# EAGLE design main_board_v2 (EAGLE 7.7.0)
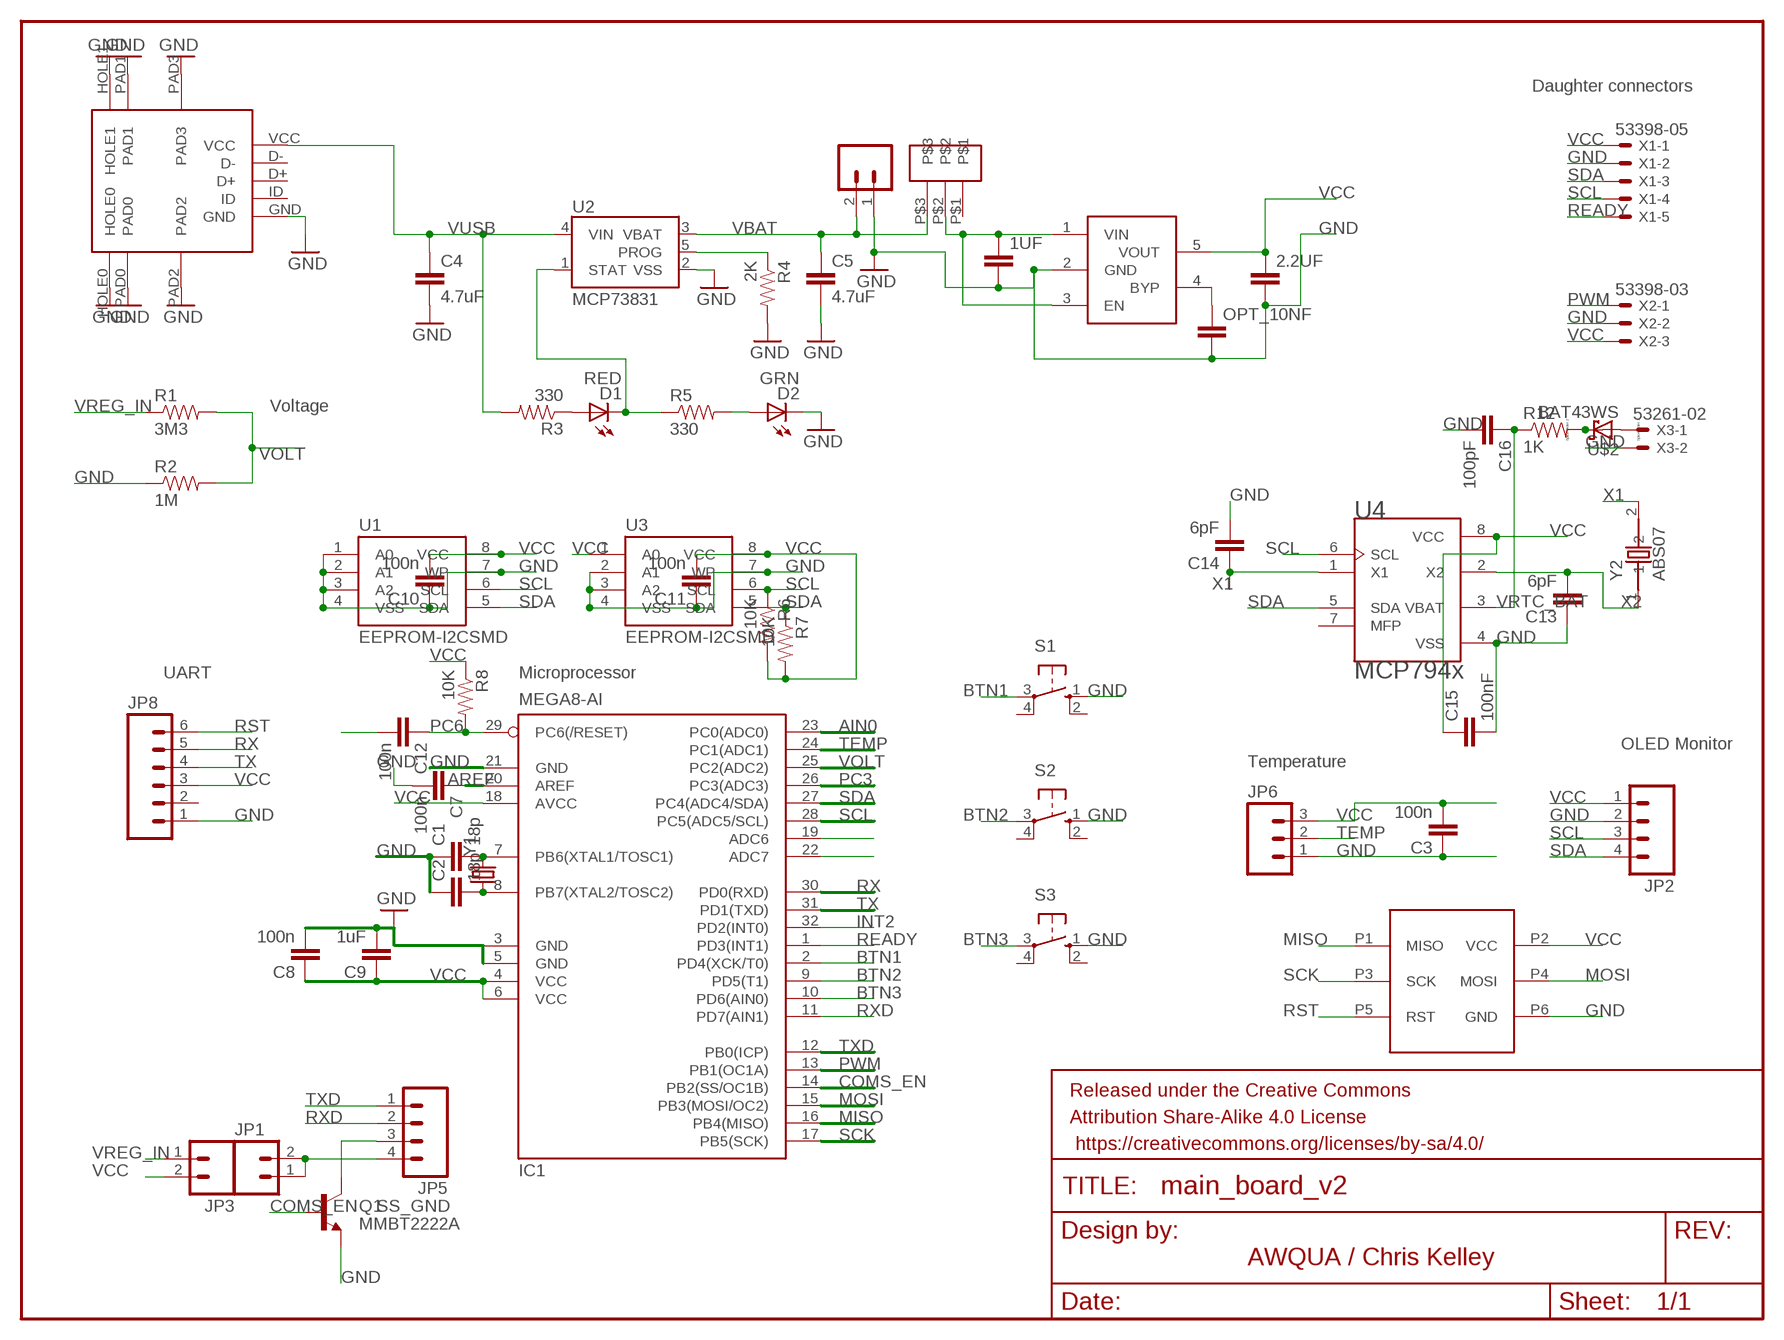
[diagram p0: schematic, sheet 1]

## Parts
1UF  CAP0603-CAP  [0603-CAP]
2.2UF  CAP0603-CAP  [0603-CAP]
C1  18p  CAP0603-CAP  [0603-CAP]
C2  18p  CAP0603-CAP  [0603-CAP]
C3  100n  CAP0603-CAP  [0603-CAP]
C4  4.7uF  CAP0402-CAP  [0402-CAP]
C5  4.7uF  CAP0402-CAP  [0402-CAP]
C7  100n  CAP0603-CAP  [0603-CAP]
C8  100n  CAP0603-CAP  [0603-CAP]
C9  1uF  CAP0603-CAP  [0603-CAP]
C10  100n  CAP0603-CAP  [0603-CAP]
C11  100n  CAP0603-CAP  [0603-CAP]
C12  100n  CAP0603-CAP  [0603-CAP]
C13  6pF  CAP0603-CAP  [0603-CAP]
C14  6pF  CAP0603-CAP  [0603-CAP]
C15  100nF  CAP0603-CAP  [0603-CAP]
C16  100pF  CAP0603-CAP  [0603-CAP]
D1  RED  LED0603  [LED-0603]
D2  GRN  LED0603  [LED-0603]
FRAME1  FRAME-LETTER  [CREATIVE_COMMONS]
IC1  MEGA8-AI  [TQFP32-08]
JP1  M02PTH  [1X02]
JP2  M04PTH  [1X04]
JP3  M02PTH  [1X02]
JP5  M04PTH  [1X04]
JP6  M03PTH  [1X03]
JP7  LiPo Battery  M02-JST-2MM-SMT  [JST-2-SMD]
JP8  M06SILK_FEMALE_PTH  [1X06]
OPT_10NF  CAP0603-CAP  [0603-CAP]
Q1  MMBT2222A  TRANSISTOR_NPNMMBT2222A  [SOT23-3]
R1  3M3  RESISTOR0603  [0603-RES]
R2  1M  RESISTOR0603  [0603-RES]
R3  330  RESISTOR0402-RES  [0402-RES]
R4  2K  RESISTOR0402-RES  [0402-RES]
R5  330  RESISTOR0402-RES  [0402-RES]
R6  10K  RESISTOR0603-RES  [0603-RES]
R7  10K  RESISTOR0603-RES  [0603-RES]
R8  10K  RESISTOR0402-RES  [0402-RES]
R12  1K  RESISTOR0603-RES  [0603-RES]
S1  40-XX  [B3F-40XX]
S2  40-XX  [B3F-40XX]
S3  40-XX  [B3F-40XX]
U1  EEPROM-I2CSMD  [SO08]
U2  MCP73831  [SOT23-5]
U3  EEPROM-I2CSMD  [SO08]
U4  MCP794x  MCP7940M-I/SN  [SOIC127P600X175-8N]
U$1  ISP-SMD-6PIN  [ISP-SMD-6PIN]
U$2  BAT43WS  [BAT43WS]
U$3  USBMICRO-10118193-0001LF  [USBMICRO-10118193-0001LF]
U$6  LP2985  [LP2985]
U$7  OS102-SPDT-SWITCH  [OS102-SPDT-SWITCH]
X1  53398-05  [53398-05]
X2  53398-03  [53398-03]
X3  53261-02  [53261-02]
Y1  CRYSTAL5X3  [CRYSTAL-SMD-5X3]
Y2  ABS07  ABS07-32.768KHZ-T  [XTAL320X150X90]

## Nets
AIN0: IC1.23(PC0(ADC0))
AREF: C7.1 IC1.20(AREF)
BTN1: IC1.2(PD4(XCK/T0)) S1.3(P)
BTN2: IC1.9(PD5(T1)) S2.3(P)
BTN3: IC1.10(PD6(AIN0)) S3.3(P)
BYPASS: OPT_10NF.1 U$6.4(BYP)
COMS_EN: IC1.14(PB2(SS/OC1B)) Q1.1(B)
GND: 1UF.2 2.2UF.2 C1.1 C2.1 C3.1 C4.2 C5.2 C7.2 C8.2 C9.2 C10.1 C11.1 C13.1 C14.2 C15.2 C16.2 D2.C IC1.3(GND) IC1.5(GND) IC1.19(ADC6) IC1.21(GND) IC1.22(ADC7) JP2.2 JP6.1 JP7.1 JP8.1 OPT_10NF.2 Q1.2(E) R2.1 R4.2 S1.1(S) S2.1(S) S3.1(S) U1.1(A0) U1.2(A1) U1.3(A2) U1.4(VSS) U1.7(WP) U2.2(VSS) U3.2(A1) U3.3(A2) U3.4(VSS) U3.7(WP) U4.4(VSS) U$1.P6(GND) U$3.GND U$3.HOLE0 U$3.HOLE1 U$3.PAD0 U$3.PAD1 U$3.PAD2 U$3.PAD3 U$6.2(GND) X1.2 X2.2 X3.2
INT2: IC1.32(PD2(INT0))
MISO: IC1.16(PB4(MISO)) U$1.P1(MISO)
MOSI: IC1.15(PB3(MOSI/OC2)) U$1.P4(MOSI)
N$1: D1.A R3.1
N$2: U$2.PIN1(C) X3.1
N$3: JP1.1 JP1.2 JP5.4
N$4: R12.2 U$2.PIN2(A)
N$5: D2.A R5.2
PC3: IC1.26(PC3(ADC3))
PC6: C12.1 IC1.29(PC6(/RESET)) R8.2
PROG: R4.1 U2.5(PROG)
PWM: IC1.13(PB1(OC1A)) X2.1
Q1: C2.2 IC1.8(PB7(XTAL2/TOSC2)) Y1.1
Q2: C1.2 IC1.7(PB6(XTAL1/TOSC1)) Y1.3
READY: IC1.1(PD3(INT1)) X1.5
RST: C12.2 JP8.6 U$1.P5(RST)
RX: IC1.30(PD0(RXD)) JP8.5
RXD: IC1.11(PD7(AIN1)) JP5.2
SCK: IC1.17(PB5(SCK)) U$1.P3(SCK)
SCL: IC1.28(PC5(ADC5/SCL)) JP2.3 R6.1 U1.6(SCL) U3.6(SCL) U4.6(SCL) X1.4
SDA: IC1.27(PC4(ADC4/SDA)) JP2.4 R7.1 U1.5(SDA) U3.5(SDA) U4.5(SDA) X1.3
SS_GND: JP5.3 Q1.3(C)
STAT: D1.C R5.1 U2.1(STAT)
TEMP: IC1.24(PC1(ADC1)) JP6.2
TX: IC1.31(PD1(TXD)) JP8.4
TXD: IC1.12(PB0(ICP)) JP5.1
VBAT: C5.1 JP7.2 U2.3(VBAT) U$7.P$3
VCC: 2.2UF.1 C3.2 C8.1 C9.1 C10.2 C11.2 C15.1 IC1.4(VCC) IC1.6(VCC) IC1.18(AVCC) JP2.1 JP3.2 JP6.3 JP8.3 R6.2 R7.2 R8.1 U1.8(VCC) U3.1(A0) U3.8(VCC) U4.8(VCC) U$1.P2(VCC) U$6.5(VOUT) X1.1 X2.3
VOLT: IC1.25(PC2(ADC2)) R1.2 R2.2
VREG_IN: 1UF.1 JP3.1 R1.1 U$6.1(VIN) U$6.3(EN) U$7.P$2
VRTC_BAT: C16.1 R12.1 U4.3(VBAT)
VUSB: C4.1 R3.2 U2.4(VIN) U$3.VCC
X1: C14.1 U4.1(X1) Y2.2
X2: C13.2 U4.2(X2) Y2.1
Unconnected: JP8.2 S1.2(S1) S1.4(P1) S2.2(S1) S2.4(P1) S3.2(S1) S3.4(P1) U4.7(MFP) U$3.D+ U$3.D- U$3.ID U$7.P$1

## Notes on the sheet
- Daughter connectors
- Voltage
- UART | Microprocessor
- OLED Monitor
- Temperature
- AWQUA / Chris Kelley

## Library data of the parts
1UF 2.2UF C13-C16 OPT_10NF = SparkFun-Passives:CAP: Capacitor Standard 0603 ceramic capacitor, and 0.1" leaded capacitor.
C1-C5 C7-C12 = SparkFun:CAP: Capacitor Standard 0603 ceramic capacitor, and 0.1" leaded capacitor.
D1 D2 = SparkFun:LED: LEDs Standard schematic elements and footprints for 5mm, 3mm, 1206, and 0603 sized LEDs. 5mm - Spark Fun Electronics SKU : COM-00529 (and others)
FRAME1 = SparkFun-Aesthetics:FRAME-LETTER: Schematic Frame Standard 8.5x11 US Letter frame
IC1 = atmel:MEGA8: MICROCONTROLLER 8 Kbytes FLASH, 1 kbytes SRAM, 512 bytes EEPROM, USART, 6-channel 10 bit ADC, 2-channel 8 bit ADC Pin compatible with Atmega48, ATMega88, ATMega168 Source: avr.lbr; MPN: ATMEGA8-16AU; OC_FARNELL: 9171371; OC_NEWARK: 73M8863
JP1 JP3 = SparkFun-Connectors:M02: Standard 2-pin 0.1" header. Use with - straight break away headers ( PRT-00116) - right angle break away headers (PRT-00553) - swiss pins (PRT-00743) - machine pins (PRT-00117) - female headers (PRT-00115) Molex polarized connector foot print use with: PRT-08233 with associated crimp pins and housings. 2.54_SCREWTERM for use with PRT-10571. 3.5mm Screw Terminal footprints for PRT-08084 5mm Screw Terminal footprints for use with PRT-08432
JP2 JP5 = SparkFun-Connectors:M04: Header 4 Standard 4-pin 0.1" header. Use with straight break away headers (SKU : PRT-00116), right angle break away headers (PRT-00553), swiss pins (PRT-00743), machine pins (PRT-00117), and female headers (PRT-00115). Molex polarized connector foot print use with SKU : PRT-08231 with associated crimp pins and housings. 1MM SMD Version SKU: PRT-10208
JP6 = SparkFun-Connectors:M03: Header 3 Standard 3-pin 0.1" header. Use with straight break away headers (SKU : PRT-00116), right angle break away headers (PRT-00553), swiss pins (PRT-00743), machine pins (PRT-00117), and female headers (PRT-00115). Molex polarized connector foot print use with SKU : PRT-08232 with associated crimp pins and housings.
JP7 = SparkFun:M02: Header 2 Standard 2-pin 0.1" header. Use with straight break away headers (SKU : PRT-00116), right angle break away headers (PRT-00553), swiss pins (PRT-00743), machine pins (PRT-00117), and female headers (PRT-00115). Molex polarized connector foot print use with SKU : PRT-08233 with associated crimp pins and housings.
JP8 = SparkFun-Connectors:M06: Header 6 Standard 6-pin 0.1" header. Use with straight break away headers (SKU : PRT-00116), right angle break away headers (PRT-00553), swiss pins (PRT-00743), machine pins (PRT-00117), and female headers (PRT-00115). Molex polarized connector foot print use with SKU : PRT-08094 with associated crimp pins and housings. NOTES ON THE VARIANTS LOCK and LOCK_LONGPADS... This footprint was designed to help hold the alignment of a through-hole component (i.e. 6-pin header) while soldering it into place. You may notice that each hole has been shifted either up or down by 0.005 of an inch from it's more standard position (which is a perfectly straight line). This slight alteration caused the pins (the squares in the middle) to touch the edges of the holes. Because they are alternating, it causes a "brace" to hold the component in place. 0.005 has proven to be the perfect amount of "off-center" position when using our standard breakaway headers. Although looks a little odd when you look at the bare footprint, once you have a header in there, the alteration is very hard to notice. Also,if you push a header all the way into place, it is covered up entirely on the bottom side. This idea of altering the position of holes to aid alignment will be further integrated into the Sparkfun Library for other footprints. It can help hold any component with 3 or more connection pins.; PROD_ID: CONN-08437
Q1 = SparkFun-DiscreteSemi:TRANSISTOR_NPN: Generic NPN BJT MMBT2222A - TRANS-08049 (SOT-23, 1A 40V) MPSA42 - TRANS-09116 (SOT-23, 500mA 300V) MMBT5088LT1G - TRANS-11160 (SOT-23, 50 mA 30V) BC547 - COM-08928 <http://www.sparkfun.com/products/8928> (TO-92 45V 100mA) (1.Collector 2.Base 3.Emitter) 2N3904 - COM-00521 <http://www.sparkfun.com/products/521> (TO-92 40V 200mA) (1.Emitter 2.Base 3.Collector) P2N2222A - COM-12852 <http://www.sparkfun.com/products/12852> (TO-92 40V 600mA) (1.Collector 2.Base 3.Emitter); PROD_ID: TRANS-08049
R1 R2 = SparkFun-Resistors:RESISTOR: Resistor Basic schematic elements and footprints for 0603, 1206, and PTH resistors.
R3-R8 = SparkFun:RESISTOR: Resistor Basic schematic elements and footprints for 0603, 1206, and PTH resistors.
R12 = SparkFun-Passives:RESISTOR: Resistor Basic schematic elements and footprints for 0603, 1206, and PTH resistors.
S1-S3 = adafruit:40-XX: OMRON SWITCH; MF: OMRON COMPONENTS USA; MPN: B3F-4000; OC_FARNELL: 176434; OC_NEWARK: 36K3105
U1 U3 = SparkFun-DigitalIC:EEPROM-I2C: I2C EEPROM chips, 24LC256 (and others)
U2 = SparkFun:MCP73831: Microchip's MCP73831 Miniature single cell, fully integrated Li-Ion, Li-polymer charge management controller http://ww1.microchip.com/downloads/en/DeviceDoc/21984a.pdf
U4 = MCP7940M-I_SN:MCP7940M-I/SN: MCP7940M Series 5.5 V 64 byte I2C Real-Time Clock/Calendar with SRAM - SOIC-8; AVAILABILITY: Good; DESCRIPTION: MCP7940M Series 5.5 V 64 byte I2C Real-Time Clock/Calendar with SRAM - SOIC-8; MF: Microchip; MP: MCP7940M-I/SN; PACKAGE: SOIC-8 Microchip; PRICE: 0.62 USD
U$1 = awqua_eagle_library:ISP-SMD-6PIN
U$2 = BAT43WS:BAT43WS
U$3 = awqua_eagle_library:USBMICRO-10118193-0001LF
U$6 = awqua_eagle_library:LP2985
U$7 = awqua_eagle_library:OS102-SPDT-SWITCH
X1 = con-molex:53?-05: CONNECTOR wire to board 1.25 mm (.049 inch) pitch header; OC_FARNELL: 1125354; OC_NEWARK: unknown
X2 = con-molex:53?-03: CONNECTOR wire to board 1.25 mm (.049 inch) pitch header; OC_FARNELL: unknown; OC_NEWARK: unknown
X3 = con-molex:53?-02: CONNECTOR wire to board 1.25 mm (.049 inch) pitch header; OC_FARNELL: 1125373; OC_NEWARK: unknown
Y1 = SparkFun:CRYSTAL: Crystals Various standard crystals. Proven footprints. Spark Fun Electronics SKU : COM-00534
Y2 = ABS07-32.768KHZ-T:ABS07-32.768KHZ-T: ABS07 Series 32.768 kHz ±20 ppm 12.5 pF -40 to +85 °C SMT Low Profile Crystal; AVAILABILITY: Good; DESCRIPTION: ABS07 Series 32.768 kHz %C2%B120 ppm 12.5 pF -40 to %2B85 %C2%B0C SMT Low Profile Crystal; MF: Abracon; MP: ABS07-32.768KHZ-T; PACKAGE: 0805 Abracon; PRICE: 0.44 USD

## Board
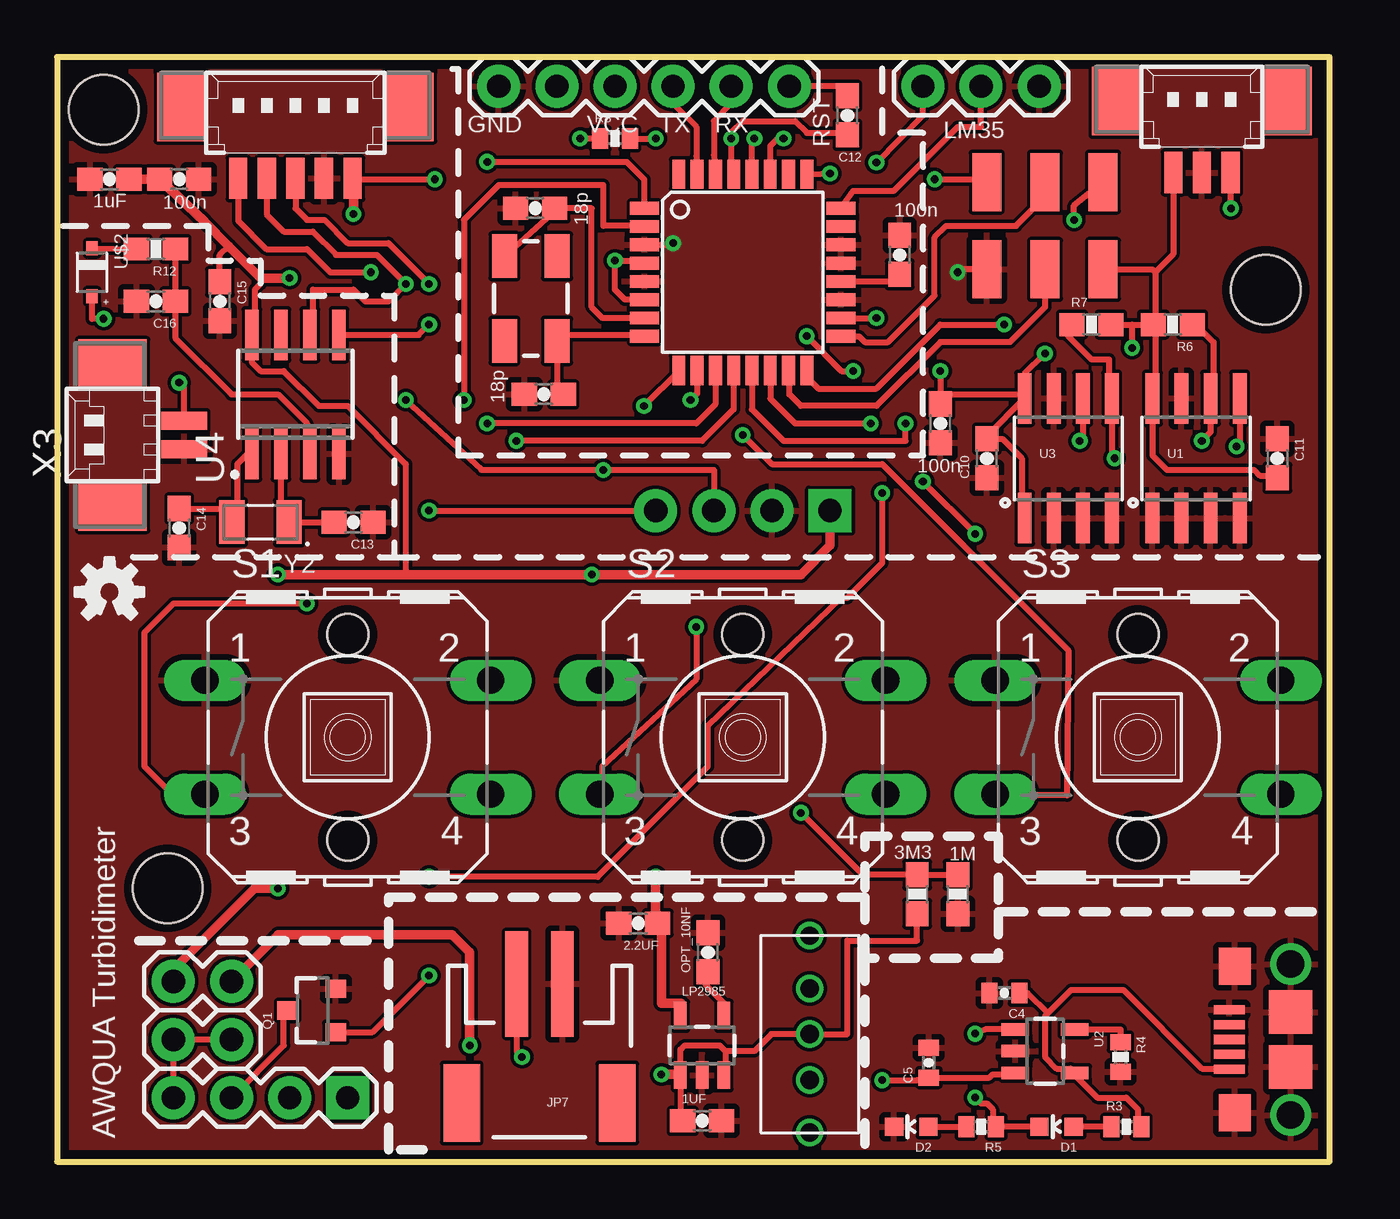
[diagram p1: board, top side]
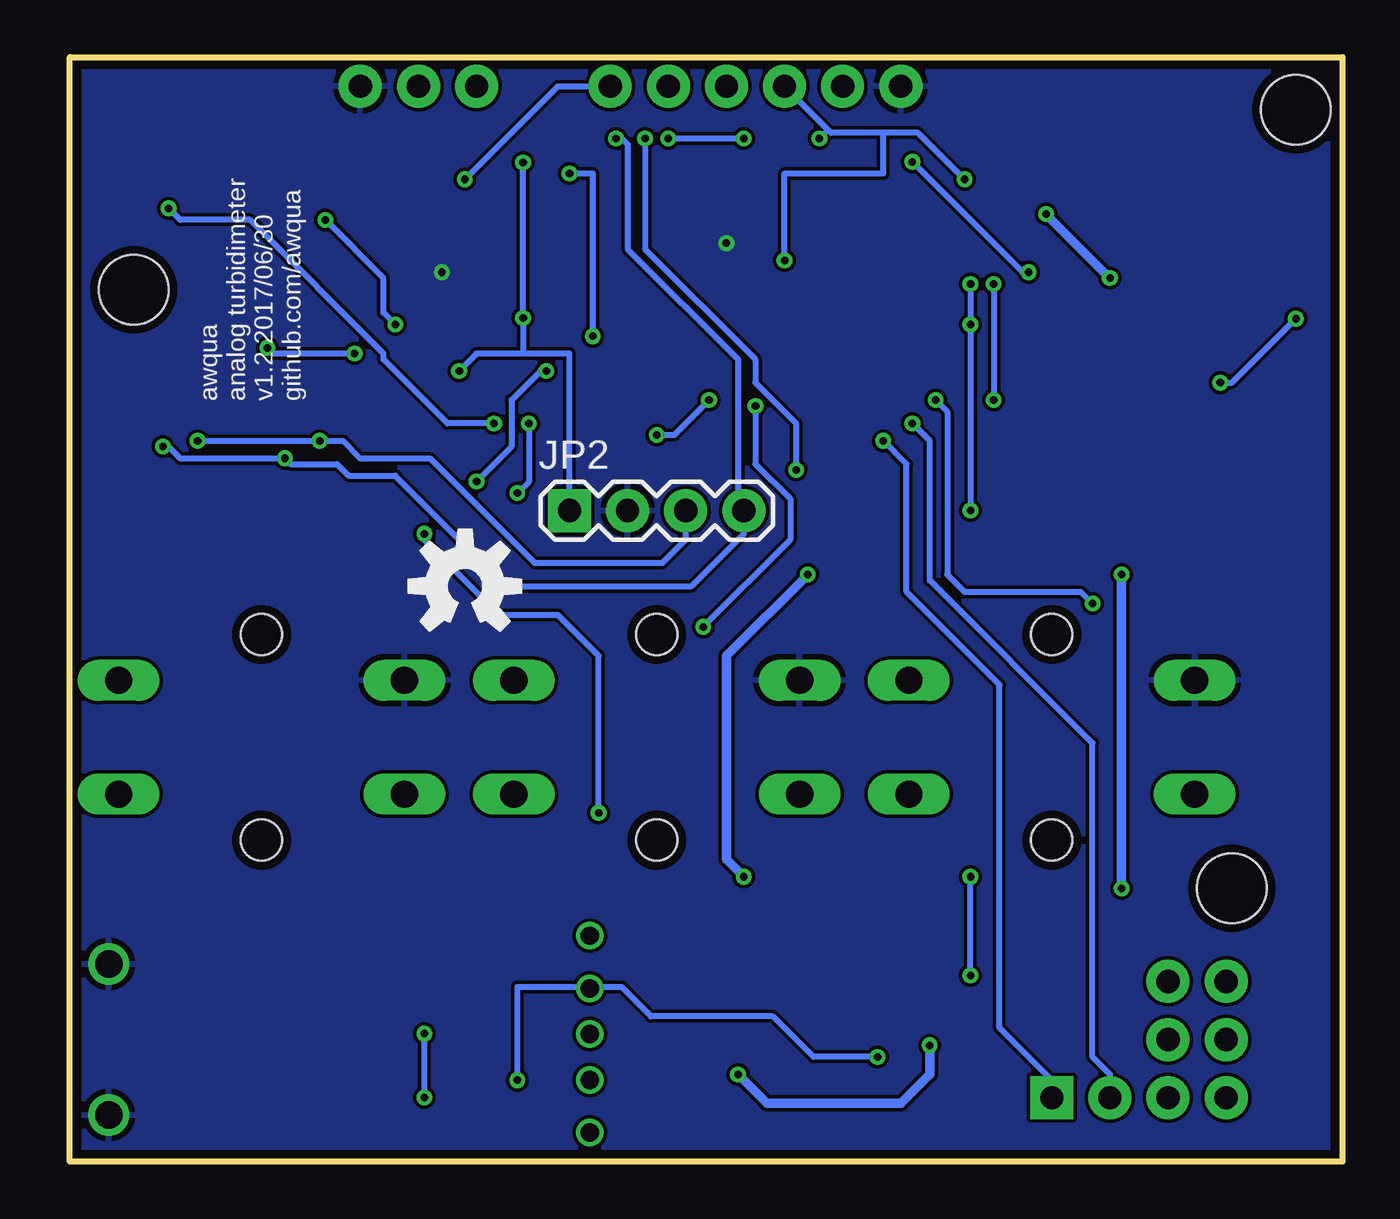
[diagram p2: board, bottom side, seen from below]

Size 55.63 x 48.26 mm. Coordinates in mm from the lower left corner, seen from the top.
Outline: 0,0 55.63,0 55.63,48.26 0,48.26 0,0
Copper layers (1*16): Top 0.0356mm / dielectric 1.5011mm / Bottom 0.0356mm
Design rules "default *": minimum track width 6mil, minimum drill 13mil, track to track 6mil, track to pad 6mil, pad to pad 6mil, via to via 6mil, smd to smd 6mil, copper to edge 15mil, drill to drill 6mil, minimum pad ring 7mil, minimum via ring 7mil, stop-mask expansion 4mil, vias tented up to drill 15mil, thermal gap 10mil
Holes 3.05 mm at 2.03,45.97 52.83,38.1 4.83,11.94

### Footprints (pad centres in the part's own frame; a part is rotated, then mirrored left to right if it is on the bottom)
0603-CAP = smd 1.1 x 1: 1 -0.85,0; 2 0.85,0
0402-CAP = smd 0.7 x 0.9: 1 -0.65,0; 2 0.65,0
LED-0603 = smd 0.8 x 0.8: A 0,-0.75; C 0,0.75
TQFP32-08 = smd 1.27 x 0.559: 1 -4.293,2.8; 2 -4.293,2; 3 -4.293,1.2; 4 -4.293,0.4; 5 -4.293,-0.4; 6 -4.293,-1.2; 7 -4.293,-2; 8 -4.293,-2.8; 17 4.293,-2.8; 18 4.293,-2; 19 4.293,-1.2; 20 4.293,-0.4; 21 4.293,0.4; 22 4.293,1.2; 23 4.293,2; 24 4.293,2.8 | smd 0.559 x 1.27: 9 -2.8,-4.293; 10 -2,-4.293; 11 -1.2,-4.293; 12 -0.4,-4.293; 13 0.4,-4.293; 14 1.2,-4.293; 15 2,-4.293; 16 2.8,-4.293; 25 2.8,4.293; 26 2,4.293; 27 1.2,4.293; 28 0.4,4.293; 29 -0.4,4.293; 30 -1.2,4.293; 31 -2,4.293; 32 -2.8,4.293
1X02 = drill 1.016 pad 1.88: 1 0,0; 2 2.54,0
1X04 = drill 1.016 pad 1.88 square: 1 0,0 | drill 1.016 pad 1.88: 2 2.54,0; 3 5.08,0; 4 7.62,0
1X03 = drill 1.016 pad 1.88: 1 0,0; 2 2.54,0; 3 5.08,0
JST-2-SMD = smd 1 x 4.6: 1 -1,-3.7; 2 1,-3.7 | smd 1.6 x 3.4: NC1 -3.4,1.5; NC2 3.4,1.5
1X06 = drill 1.016 pad 1.88: 1 0,0; 2 2.54,0; 3 5.08,0; 4 7.62,0; 5 10.16,0; 6 12.7,0
SOT23-3 = smd 0.8 x 0.9: 1 -0.95,-1; 2 0.95,-1; 3 0,1.1
0603-RES = smd 1.1 x 1: 1 -0.85,0; 2 0.85,0
0402-RES = smd 0.7 x 0.9: 1 -0.65,0; 2 0.65,0
B3F-40XX = drill 1.194 long: 1 -6.248,2.489; 2 6.248,2.489; 3 -6.248,-2.489; 4 6.248,-2.489 | hole 1.803: 0,-4.496; 0,4.496
SO08 = smd 0.61 x 2.21: 1 -1.905,-2.616; 2 -0.635,-2.616; 3 0.635,-2.616; 4 1.905,-2.616; 5 1.905,2.616; 6 0.635,2.616; 7 -0.635,2.616; 8 -1.905,2.616
SOT23-5 = smd 0.55 x 1.2: 1 -0.95,-1.3; 2 0,-1.3; 3 0.95,-1.3; 4 0.95,1.3; 5 -0.95,1.3
SOIC127P600X175-8N = smd 2.2 x 0.6: 1 -2.6,1.905; 2 -2.6,0.635; 3 -2.6,-0.635; 4 -2.6,-1.905; 5 2.6,-1.905; 6 2.6,-0.635; 7 2.6,0.635; 8 2.6,1.905
ISP-SMD-6PIN = smd 1.27 x 2.54: P1 2.54,1.905; P2 2.54,-1.905; P3 0,1.905; P4 0,-1.905; P5 -2.54,1.905; P6 -2.54,-1.905
BAT43WS = smd 0.6 x 0.5: PIN1 1.05,0; PIN2 -1.05,0
USBMICRO-10118193-0001LF = smd 0.4 x 1.35: D+ 0,4.125; D- -0.65,4.125; GND 1.3,4.125; ID 0.65,4.125; VCC -1.3,4.125 | drill 1.2 pad 1.6: HOLE0 3.3,1.45; HOLE1 -3.3,1.45 | smd 1.9 x 1.9: PAD0 1.2,1.45; PAD1 -1.2,1.45 | smd 1.6 x 1.4: PAD2 3.2,3.9; PAD3 -3.2,3.9
LP2985 = smd 0.55 x 1.2: 1 0.32,-0.03; 2 1.27,-0.03; 3 2.22,-0.03; 4 2.22,2.57; 5 0.32,2.57
OS102-SPDT-SWITCH = drill 0.8: ANCHOR1 0,2.15; ANCHOR2 8.6,2.15; P$1 2.3,2.15; P$2 4.3,2.15; P$3 6.3,2.15
53398-05 = smd 0.8 x 1.8: 1 2.5,-2.5; 2 1.25,-2.5; 3 0,-2.5; 4 -1.25,-2.5; 5 -2.5,-2.5 | smd 2.1 x 3: S1 5,0.625; S2 -5,0.625
53398-03 = smd 0.8 x 1.8: 1 1.25,-2.5; 2 0,-2.5; 3 -1.25,-2.5 | smd 2.1 x 3: S1 3.75,0.625; S2 -3.75,0.625
53261-02 = smd 0.8 x 2: 1 0.625,-2.5; 2 -0.625,-2.5 | smd 2.1 x 3: S1 3.125,0.625; S2 -3.125,0.625
CRYSTAL-SMD-5X3 = smd 1.9 x 1.1: 1 -1.85,-1.15; 2 1.85,-1.15; 3 1.85,1.15; 4 -1.85,1.15
XTAL320X150X90 = smd 1.1 x 1.9: 1 -1.25,0; 2 1.25,0

### Placement (x,y rotation side)
1UF  28.19,1.78 0 top
2.2UF  25.4,10.41 180 top
C1  20.89,41.66 0 top
C2  21.27,33.53 0 top
C3  38.61,32.26 90 top
C4  41.4,7.37 180 top
C5  38.1,4.32 90 top
C7  36.83,39.62 90 top
C8  5.33,42.93 0 top
C9  2.29,42.93 180 top
C10  40.64,30.73 90 top
C11  53.34,30.73 270 top
C12  34.54,45.72 90 top
C13  12.95,27.94 180 top
C14  5.33,27.69 270 top
C15  7.11,37.59 270 top
C16  4.32,37.59 180 top
D1  43.69,1.52 90 top
D2  37.34,1.52 90 top
FRAME1  -0.64,-8.89 0 top  (outside the outline)
IC1  29.97,38.86 0 top
JP1  7.62,5.33 180 top
JP2  33.78,28.45 0 bottom
JP3  7.62,7.87 180 top
JP5  12.7,2.79 180 top
JP6  42.93,46.99 180 top
JP7  21.08,4.06 180 top
JP8  19.3,46.99 0 top
OPT_10NF  28.45,9.14 90 top
Q1  11.18,6.6 90 top
R1  37.59,11.68 90 top
R2  39.37,11.68 90 top
R3  46.74,1.52 0 top
R4  46.48,4.57 270 top
R5  40.39,1.52 180 top
R6  48.77,36.58 180 top
R7  45.21,36.58 0 top
R8  24.38,44.7 0 top
R12  4.32,39.88 180 top
S1  12.7,18.54 0 top
S2  29.97,18.54 0 top
S3  47.24,18.54 0 top
U1  49.78,30.73 0 top
U2  43.18,4.83 270 top
U3  44.2,30.73 0 top
U4  10.41,33.53 90 top
U$1  43.18,40.89 0 top
U$2  1.52,38.86 270 top
U$3  55.37,5.33 90 top
U$4  [OSHW-LOGO-M]  38.35,25.15 0 bottom
U$5  [OSHW-LOGO-S]  2.29,24.89 0 top
U$6  26.92,3.81 0 top
U$7  35.05,1.27 90 top
X1  10.41,45.47 0 top
X2  50.04,45.72 0 top
X3  3.05,31.75 90 top
Y1  20.7,37.72 90 top
Y2  8.89,27.94 180 top

### Tracks (layer width: path | path; a pad name or v marks a point on that pad's centre or on a via)
AREF
  Top 0.254: IC1.20 36.77,38.46 C7.1
BTN1  (via drill 0.33)
  Top 0.254: IC1.2 25.43,40.86 25.15,40.89 23.88,40.89 23.88,42.67 19.3,42.67 17.78,41.15 v17.78,33.27 | S1.3 6.4,16 5.08,16 3.81,17.27 3.81,23.11 5.08,24.38 v10.92,24.38
  Bottom 0.254: v17.78,33.27 17.27,32.77 17.27,25.65 16.51,24.89 11.43,24.89 v10.92,24.38
BTN2  (via drill 0.33)
  Top 0.254: IC1.9 27.17,34.54 v25.65,33.02 | v27.94,23.37 27.94,21.08 23.82,17.27 23.82,16.15 S2.3
  Bottom 0.254: v25.65,33.02 25.65,30.48 24.13,28.96 24.13,27.18 v27.94,23.37
BTN3  (via drill 0.33)
  Top 0.254: IC1.10 27.97,33.56 v27.69,33.27 | v29.97,31.75 31.24,30.48 36.07,30.48 44.2,22.35 44.15,16 41.05,16 S3.3
  Bottom 0.254: v27.69,33.27 29.21,31.75 v29.97,31.75
BYPASS
  Top 0.254: OPT_10NF.1 28.36,7.71 29.21,6.86 29.21,6.45 U$6.4
COMS_EN  (via drill 0.33)
  Top 0.254: Q1.1 13.78,5.65 v16.26,8.13 | IC1.14 31.17,33.34 32.26,32.26 v35.56,32.26 | v16.26,12.45 23.62,12.45 28.45,17.27 28.45,19.05 34.29,24.64 34.54,24.64 36.07,26.16 v36.07,29.21
  Bottom 0.254: v16.26,8.13 v16.26,12.45 | v35.56,32.26 35.56,29.72 v36.07,29.21
GND  (via drill 0.33)
  Top 0.254: IC1.3 26.85,40.06 v26.92,40.13 | U$1.P6 39.5,38.99 v39.37,38.86
  Bottom 0.254: v39.37,38.86 39.12,38.86
  pour Top: 60.45,-4.32 -7.37,-4.32 -7.37,53.34 59.94,53.09
  pour Bottom: -6.1,54.1 58.42,55.12 58.17,-7.11 -6.1,-6.86
MISO  (via drill 0.33)
  Top 0.254: IC1.16 32.77,34.28 33.27,33.78 35.81,33.78 38.61,36.58 v41.4,36.58 | v44.45,41.15 44.45,41.78 U$1.P1
  Bottom 0.254: v41.4,36.58 41.91,37.08 41.91,38.61 v44.45,41.15
MOSI
  Top 0.254: U$1.P4 43.18,37.34 41.66,35.81 38.61,35.81 35.81,33.02 32.51,33.02 32,33.53 32,34.54 IC1.15
N$1
  Top 0.254: R3.1 D1.A
N$2  (via drill 0.33)
  Top 0.254: X3.1 5.55,33.82 v5.33,34.04 | v2.03,36.83 1.52,36.83 U$2.PIN1 1.52,37.37
  Bottom 0.254: v5.33,34.04 4.83,34.04 v2.03,36.83
N$3
  Top 0.254: JP1.1 JP1.2 JP5.4
N$4
  Top 0.254: U$2.PIN2 R12.2
N$5
  Top 0.254: D2.A R5.2
PC6  (via drill 0.33)
  Top 0.254: R8.2 v26.16,44.7 | IC1.29 29.46,43.26 v29.46,44.7 29.46,44.96 29.97,45.47 32.26,45.47 32.77,44.96 34.63,44.96 C12.1
  Bottom 0.254: v26.16,44.7 v29.46,44.7
PROG
  Top 0.254: U2.5 46.48,5.78 R4.1
PWM  (via drill 0.33)
  Top 0.254: IC1.13 30.37,32.87 31.75,31.5 37.08,31.5 v37.08,32.26 | v51.31,41.66 51.31,43.2 X2.1
  Bottom 0.254: v37.08,32.26 39.12,32.26 41.91,35.05 41.91,35.31 47.75,41.15 50.8,41.15 v51.31,41.66
Q1
  Top 0.254: C2.2 21.85,33.76 Y1.1 22.32,36.12 25.65,36.12 25.65,36.07 IC1.8
Q2
  Top 0.254: IC1.7 23.84,36.86 23.37,37.34 23.37,41.66 C1.2 22,41.51 21.59,41.51 21.59,41.4 Y1.3
READY  (via drill 0.33)
  Top 0.254: X1.5 7.91,41.11 9.14,39.88 10.92,39.88 11.94,38.86 v13.72,38.86 | v18.8,43.69 24.89,43.69 25.65,42.93 25.65,41.69 IC1.1
  Bottom 0.254: v13.72,38.86 13.97,38.86 v18.8,43.69
RST  (via drill 0.33)
  Top 0.254: v38.35,42.93 40.51,42.93 U$1.P5 | C12.2 34.54,46.74 34.29,46.99 JP8.6
  Bottom 0.254: v38.35,42.93 34.29,46.99 JP8.6
RX
  Top 0.254: JP8.5 29.46,46.23 28.7,45.47 28.7,43.99 IC1.30
RXD  (via drill 0.33)
  Top 0.254: IC1.11 28.77,33.09 27.94,32.26 v18.8,32.26
  Bottom 0.254: JP5.2 10.16,3.81 10.92,4.57 10.92,18.29 18.03,25.4 18.03,31.5 v18.8,32.26
SCK
  Top 0.254: IC1.17 35.06,36.06 35.31,35.81 36.32,35.81 38.35,37.85 38.35,40.39 38.86,40.89 41.91,40.89 43.18,42.16 U$1.P3
SCL  (via drill 0.33)
  Top 0.254: R6.1 49.78,36.58 50.55,35.81 50.55,33.48 U1.6 50.42,31.88 v50.04,31.5 | IC1.28 30.37,44.6 v30.48,44.7 | U3.6 44.83,31.62 v44.7,31.5 | X1.4 9.16,41.38 9.91,40.64 11.18,40.64 12.19,39.62 13.97,39.62 v15.24,38.35 14.48,37.59 13.46,37.59 12.95,38.1 11.18,38.1 11.18,36.26 U4.6 | v15.24,33.27 18.54,30.23 v23.88,30.23 28.7,30.23 JP2.3
  Bottom 0.254: v50.04,31.5 v44.7,31.5 43.69,31.5 42.93,30.73 39.88,30.73 35.31,26.16 29.72,26.16 28.7,27.18 JP2.3 | v15.24,38.35 v15.24,33.27 | v30.48,44.7 30.48,39.88 25.65,35.05 25.65,34.04 23.88,32.26 v23.88,30.23
SDA  (via drill 0.33)
  Top 0.254: R7.1 44.2,36.58 44.2,36.07 45.21,35.05 45.97,35.05 45.97,33.48 U3.5 46.1,30.86 v46.23,30.73 | IC1.27 31.17,44.38 31.5,44.7 v31.75,44.7 | U1.5 51.69,31.37 v51.56,31.24 | X1.3 10.41,41.66 10.92,41.15 11.68,41.15 12.7,40.13 14.48,40.13 v16.26,38.35 | v16.26,28.45 JP2.4 | U4.5 15.81,36.13 v16.26,36.58
  Bottom 0.254: v51.56,31.24 51.31,31.24 50.8,30.73 v46.23,30.73 45.97,30.48 43.94,30.48 43.43,29.97 41.4,29.97 36.58,25.15 28.45,25.15 26.16,27.43 JP2.4 26.42,28.7 26.42,35.05 31.24,39.88 31.24,44.45 31.5,44.7 v31.75,44.7 | v16.26,38.35 v16.26,36.58 v16.26,28.45
SS_GND
  Top 0.254: JP5.3 9.91,5.08 9.91,6.43 Q1.3
STAT  (via drill 0.33)
  Top 0.254: D1.C R5.1 40.89,1.67 40.89,2.29 40.64,2.54 40.39,2.54 v40.13,2.79 | U2.1 40.57,5.78 v40.13,5.59
  Bottom 0.254: v40.13,5.59 v40.13,2.79
TEMP
  Top 0.254: IC1.24 34.8,42.42 36.58,42.42 39.37,45.21 40.39,45.21 JP6.2
TX
  Top 0.254: IC1.31 27.94,43.95 27.94,45.21 26.92,46.23 JP8.4
TXD  (via drill 0.33)
  Top 0.254: IC1.12 29.57,32.87 28.19,31.5 v20.07,31.5
  Bottom 0.254: JP5.1 12.7,3.56 14.99,5.84 14.99,20.83 19.05,24.89 19.05,30.48 v20.07,31.5
VBAT  (via drill 0.33)
  Top 0.254: U2.3 41.81,3.81 40.89,3.81 40.75,3.67 C5.1 37.59,3.56 v36.07,3.56 | JP7.2 20.08,4.81 v20.32,4.57
  Bottom 0.254: v36.07,3.56 36.07,7.62 33.07,7.62 U$7.P$3 32.85,7.62 31.5,7.62 30.23,6.35 24.89,6.35 23.11,4.57 v20.32,4.57
VCC  (via drill 0.33)
  Top 0.254: X2.3 48.79,39.64 48.01,38.86 | 48.01,38.86 48.01,36.69 R6.2 | R6.2 48.01,36.58 48.01,33.89 47.75,33.78 47.75,33.48 U1.8 47.88,30.86 48.51,30.23 52.32,30.23 52.58,29.97 53.25,29.97 C11.2 | U3.1 42.16,28.25 42.16,30.73 41.31,31.58 C10.2 40.64,31.7 U3.8 | v35.81,36.86 IC1.18 34.23,36.83 | v38.61,34.54 C3.2 38.61,33.53 42.11,33.53 U3.8 | U$1.P2 47.88,38.99 48.01,38.86 | IC1.4 25.57,39.37 v24.38,39.37 24.38,38.1 24.82,37.66 IC1.6 | 12.95,42.93 v16.51,42.93 | v35.81,43.66 37.85,45.72 JP6.3 | R7.2 46.99,36.58 | 46.99,36.58 R6.2 | U3.8 42.29,34.42 v43.18,35.31 | v46.99,35.56 46.99,36.58 | R8.1 v22.86,44.7 | 8.89,38.61 8.89,38.35 8.64,38.1 8.64,36.26 U4.8 8.51,34.92 8.89,34.54 9.91,34.54 11.43,33.02 12.7,33.02 15.24,30.48 15.24,25.65 | C15.1 7.11,39.62 7.49,40.01
  Top 0.406: v9.65,11.94 8.64,11.94 5.08,8.38 JP3.2 | C9.1 C8.1 6.44,41.06 7.49,40.01 8.89,38.61 v10.16,38.61 | v12.95,41.4 12.95,42.93 X1.1 | v9.65,25.65 15.24,25.65 v23.37,25.65 32.51,25.65 33.78,26.92 JP2.1 | v26.16,12.45 26.16,11.01 2.2UF.1 26.42,10.41 26.42,6.91 27.27,6.91 27.27,6.4 U$6.5
  Bottom 0.254: 35.81,35.31 v35.81,36.86 v35.81,43.66 | 35.81,35.31 37.85,35.31 v38.61,34.54 | JP2.1 33.78,35.31 35.81,35.31 | v16.51,42.93 18.54,44.96 20.07,44.96 | 20.07,44.96 22.35,44.96 22.48,45.09 | 22.48,45.09 JP8.3 | v43.18,35.31 46.74,35.31 v46.99,35.56 | v24.38,39.37 24.38,43.18 20.07,43.18 20.07,44.96 | v22.86,44.7 22.48,45.09
  Bottom 0.406: v10.16,38.61 v12.95,41.4 | v9.65,25.65 v9.65,11.94 | v26.16,12.45 26.92,13.21 26.92,22.1 v23.37,25.65
VOLT  (via drill 0.33)
  Top 0.254: R2.2 R1.2 35.22,12.53 v32.51,15.24 | IC1.25 32.99,43.16 v33.78,43.18 | v32.77,36.07 34.29,34.54 v34.8,34.54 | v37.85,29.72 v40.13,27.43
  Bottom 0.254: v32.51,15.24 32.51,22.1 34.29,23.88 36.83,23.88 40.13,27.18 v40.13,27.43 | v33.78,43.18 32.77,43.18 v32.77,36.07 | v34.8,34.54 35.05,34.54 36.32,33.27 36.32,31.24 v37.85,29.72
VREG_IN  (via drill 0.33)
  Top 0.254: 1UF.1 27.24,1.8 U$6.1 27.24,4.89 27.43,5.08 28.96,5.08 29.21,4.83 | R1.1 37.59,9.65 34.54,9.65 34.54,5.57 U$7.P$2 31.22,5.57 30.48,4.83 29.21,4.83 | 29.21,4.83 29.21,3.85 U$6.3
  Top 0.406: JP3.1 9.65,9.91 17.27,9.91 18.03,9.14 v18.03,5.08 | v26.42,3.81 27.21,3.81 U$6.1
  Bottom 0.406: v18.03,5.08 18.03,3.81 19.3,2.54 25.15,2.54 v26.42,3.81
VRTC_BAT
  Top 0.254: R12.1 C16.1 5.17,35.98 7.62,33.53 9.65,33.53 10.92,32.26 10.92,31.05 U4.3
VUSB
  Top 0.254: U$3.VCC 51.22,4.06 50.04,4.06 46.6,7.5 44.33,7.5 | 44.33,7.5 43.31,6.48 | 43.31,6.48 43.18,6.35 43.18,4.57 43.69,4.06 44.29,4.06 U2.4 44.48,3.78 45.47,2.79 46.74,2.79 47.24,2.29 47.24,1.67 R3.2 | 44.34,7.51 44.33,7.5 | C4.1 42.42,7.37 43.31,6.48
X1
  Top 0.254: C14.1 7.55,28.54 Y2.2 7.87,28.21 7.87,30.48 8.32,30.93 U4.1
X2
  Top 0.254: U4.2 9.78,28.81 Y2.1 C13.2

### Text on the board
tPlace: AWQUA Turbidimeter
bPlace: awqua / analog turbidimeter / v1.2 2017/06/30 / github.com/awqua
tNames: GND | VCC | TX | RX | RST | LM35 | AWQUA / Chris Kelley